# Altium schematic sheet AFE.SchDoc: Straingauge data acquisition board
size A4; CheckedBy: Bogdan Seczkowski; DrawnBy: Bogdan Seczkowski; Revision: A; SheetNumber: 1; SheetTotal: 2
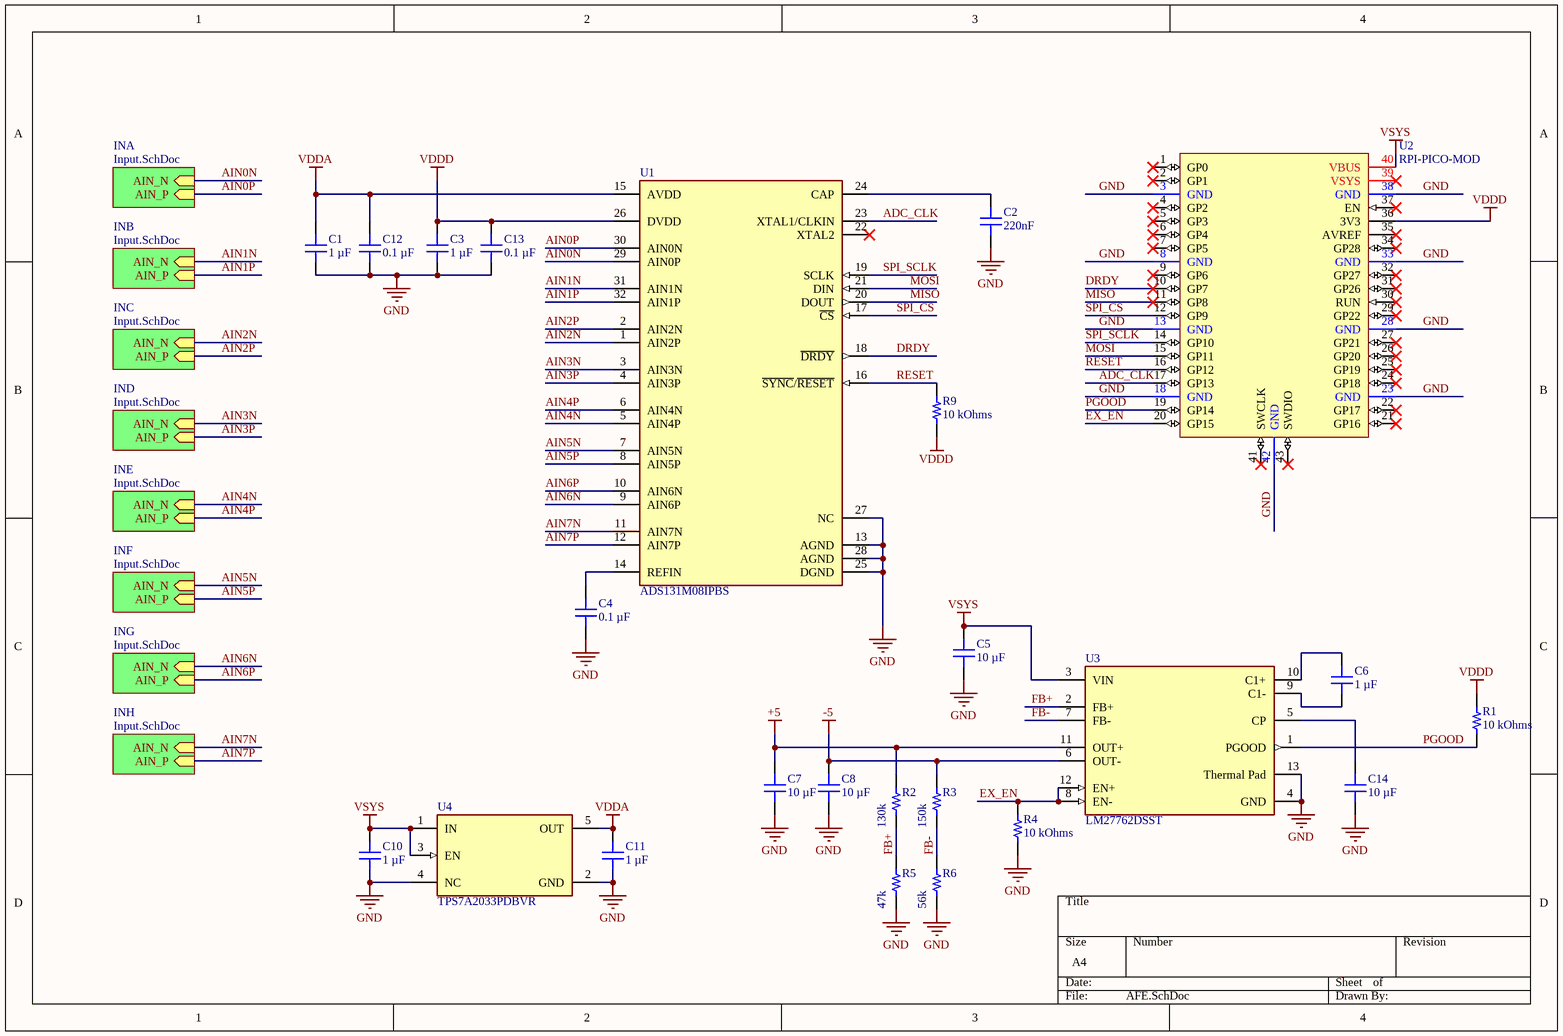
[diagram p0: AFE.SchDoc]

## Parts
C1  1 µF  [CAP 0603_1608]
C2  Capacitance: 220nF  [CAP 0603_1608]  (hidden comment: 0.22 µF)
C3  1 µF  [CAP 0603_1608]
C4  0.1 µF  [CAP 0603_1608]
C5  10 µF  [CAP 0805_2012]
C6  1 µF  [CAP 0603_1608]
C7  10 µF  [CAP 0805_2012]
C8  10 µF  [CAP 0805_2012]
C10  1 µF  [CAP 0603_1608]
C11  1 µF  [CAP 0603_1608]
C12  0.1 µF  [CAP 0603_1608]
C13  0.1 µF  [CAP 0603_1608]
C14  10 µF  [CAP 0805_2012]
R1  10 kOhms  [RES 0603_1608]
R2  130k  [RES 0603_1608]
R3  150k  [RES 0603_1608]
R4  10 kOhms  [RES 0603_1608]
R5  47k  [RES 0603_1608]
R6  56k  [RES 0603_1608]
R9  10 kOhms  [RES 0603_1608]
U1  ADS131M08IPBS  [FP-PBS0032A-MFG]
U2  RPI-PICO-MOD  [RPI-PICO-MOD]
U3  LM27762DSST  [FP-DSS0012B-MFG]
U4  TPS7A2033PDBVR  [FP-DBV0005A-MFG]

## Sub-sheets
INA = Input.SchDoc: AIN_N (in), AIN_P (in)
INB = Input.SchDoc: AIN_N (in), AIN_P (in)
INC = Input.SchDoc: AIN_N (in), AIN_P (in)
IND = Input.SchDoc: AIN_N (in), AIN_P (in)
INE = Input.SchDoc: AIN_N (in), AIN_P (in)
INF = Input.SchDoc: AIN_N (in), AIN_P (in)
ING = Input.SchDoc: AIN_N (in), AIN_P (in)
INH = Input.SchDoc: AIN_N (in), AIN_P (in)

## Nets
+5: C7.2 R2.2 U3.11(OUT+)
-5: C8.2 R3.2 U3.6(OUT-)
GND: C1.1 C2.1 C3.1 C4.1 C5.1 C7.1 C8.1 C10.1 C11.1 C12.1 C13.1 C14.1 R4.1 R5.1 R6.1 U1.13(AGND) U1.25(DGND) U1.27(NC) U1.28(AGND) U2.3(GND) U2.8(GND) U2.13(GND) U2.18(GND) U2.23(GND) U2.28(GND) U2.33(GND) U2.38(GND) U2.42(GND) U3.4(GND) U3.13(Thermal_Pad) U4.2(GND) U4.4(NC)
VDDA: C1.2 C11.2 C12.2 U1.15(AVDD) U4.5(OUT)
VDDD: C3.2 C13.2 R1.2 R9.1 U1.26(DVDD) U2.36(3V3)
VSYS: C5.2 C10.2 U2.40(VBUS) U3.3(VIN) U4.1(IN) U4.3(EN)
ADC_CLK: U1.23(XTAL1/CLKIN) U2.17(GP13)
AIN0N: U1.29(AIN0P) ; sheet INA/AIN_N
AIN0P: U1.30(AIN0N) ; sheet INA/AIN_P
AIN1N: U1.31(AIN1N) ; sheet INB/AIN_N
AIN1P: U1.32(AIN1P) ; sheet INB/AIN_P
AIN2N: U1.1(AIN2P) ; sheet INC/AIN_N
AIN2P: U1.2(AIN2N) ; sheet INC/AIN_P
AIN3N: U1.3(AIN3N) ; sheet IND/AIN_N
AIN3P: U1.4(AIN3P) ; sheet IND/AIN_P
AIN4N: U1.5(AIN4P) ; sheet INE/AIN_N
AIN4P: U1.6(AIN4N) ; sheet INE/AIN_P
AIN5N: U1.7(AIN5N) ; sheet INF/AIN_N
AIN5P: U1.8(AIN5P) ; sheet INF/AIN_P
AIN6N: U1.9(AIN6P) ; sheet ING/AIN_N
AIN6P: U1.10(AIN6N) ; sheet ING/AIN_P
AIN7N: U1.11(AIN7N) ; sheet INH/AIN_N
AIN7P: U1.12(AIN7P) ; sheet INH/AIN_P
DRDY: U1.18(~{DRDY}) U2.10(GP7)
EX_EN: R4.2 U2.20(GP15) U3.8(EN-) U3.12(EN+)
FB+: R2.1 R5.2 U3.2(FB+)
FB-: R3.1 R6.2 U3.7(FB-)
MISO: U1.20(DOUT) U2.11(GP8)
MOSI: U1.21(DIN) U2.15(GP11)
PGOOD: R1.1 U2.19(GP14) U3.1(PGOOD)
RESET: R9.2 U1.16(~{SYNC}/~{RESET}) U2.16(GP12)
SPI_CS: U1.17(~{CS}) U2.12(GP9)
SPI_SCLK: U1.19(SCLK) U2.14(GP10)
NetC2_2: C2.2 U1.24(CAP)
NetC4_2: C4.2 U1.14(REFIN)
NetC6_1: C6.1 U3.9(C1-)
NetC6_2: C6.2 U3.10(C1+)
NetC14_2: C14.2 U3.5(CP)

Not connected (* = marked no-connect by the designer): U1 22(XTAL2)*; U2 1(GP0)* 2(GP1)* 4(GP2)* 5(GP3)* 6(GP4)* 7(GP5)* 9(GP6)* 21(GP16)* 22(GP17)* 24(GP18)* 25(GP19)* 26(GP20)* 27(GP21)* 29(GP22)* 30(RUN)* 31(GP26)* 32(GP27)* 34(GP28)* 35(AVREF)* 37(EN)* 39(VSYS)* 41(SWCLK)* 43(SWDIO)*

## Library data of the parts
C1 C3 C10 C11 = C0603C105K4RACAUTO: CAP CER 1UF 16V X7R 0603; manufacturer: KEMET; Tolerance: ±10%; Part Number: C0603C105K4RACAUTO; Capacitance: 1 µF; Applications: Automotive, Bypass, Decoupling; componentlink1description: Datasheet; componentlink1url: https://api.kemet.com/component-edge/download/datasheet/C0603C105K4RACAUTO.pdf; componentlink2description: DigiKey Link; componentlink2url: https://www.digikey.com/en/products/detail/kemet/C0603C105K4RACAUTO/8635831; Device Package: 0603 (1608 Metric); lastupdated: 2/9/2024 8:10:30 PM; Lifecycle Status: Active; Minimum Order: 1; Mounting Type: Surface Mount, MLCC; Operating Temperature: -55°C ~ 125°C; Package / Case: 0603 (1608 Metric); packaging: TapeAndReel; partid: 2179; Part Status: Active; price: 0.01; Ratings: AEC-Q200; series: SMD Auto X7R; Size / Dimension: 0.063" L x 0.031" W (1.60mm x 0.80mm); Supplier 1: DigiKey; Supplier Part Number 1: 399-17704-1-ND; Temperature Coefficient: X7R; Thickness (Max): 0.037" (0.95mm); value: 1 µF; Voltage - Rated: 16V
C2 = 0603BB224K500YT: CAP CER 0.22UF 50V X7R 0603; manufacturer: Knowles Novacap; Tolerance: ±10%; Part Number: 0603BB224K500YT; Applications: General Purpose; componentlink1description: Datasheet; componentlink1url: https://www.knowlescapacitors.com/getattachment/6c8d48ef-fc2b-4752-ae2c-ce6c208de0c4/High-Capacitance-Chip.aspx; componentlink2description: DigiKey Link; componentlink2url: https://www.digikey.com/en/products/detail/knowles-novacap/0603BB224K500YT/7304085; Device Package: 0603 (1608 Metric); lastupdated: 2/9/2024 8:10:30 PM; Lifecycle Status: Active; Minimum Order: 1; Mounting Type: Surface Mount, MLCC; Operating Temperature: -55°C ~ 125°C; Package / Case: 0603 (1608 Metric); packaging: TapeAndReel; partid: 2162; Part Status: Active; price: 0.49; series: -; Size / Dimension: 0.060" L x 0.030" W (1.52mm x 0.76mm); Supplier 1: DigiKey; Supplier Part Number 1: 1763-1192-1-ND; Temperature Coefficient: X7R; Thickness (Max): 0.035" (0.89mm); value: 0.22 µF; Voltage - Rated: 50V
C4 C12 C13 = C0603C104K5RAC7411: CAP CER 0.1UF 50V X7R 0603; manufacturer: KEMET; Tolerance: ±10%; Part Number: C0603C104K5RAC7411; Capacitance: 0.1 µF; Applications: Bypass, Decoupling; componentlink1description: Datasheet; componentlink1url: https://api.kemet.com/component-edge/download/datasheet/C0603C104K5RAC7411.pdf; componentlink2description: DigiKey Link; componentlink2url: https://www.digikey.com/en/products/detail/kemet/C0603C104K5RAC7411/3317013; Device Package: 0603 (1608 Metric); lastupdated: 2/9/2024 8:10:30 PM; Lifecycle Status: Active; Minimum Order: 1; Mounting Type: Surface Mount, MLCC; Operating Temperature: -55°C ~ 125°C; Package / Case: 0603 (1608 Metric); packaging: TapeAndReel; partid: 2233; Part Status: Active; price: 0.01; series: SMD Comm X7R; Size / Dimension: 0.063" L x 0.031" W (1.60mm x 0.80mm); Supplier 1: DigiKey; Supplier Part Number 1: 399-C0603C104K5RAC7411CT-ND; Temperature Coefficient: X7R; Thickness (Max): 0.035" (0.90mm); value: 0.1 µF; Voltage - Rated: 50V
C5 C7 C8 C14 = CL21Y106KPQVPNE: CAP CER 10UF 10V X7S 0805; manufacturer: Samsung Electro-Mechanics; Tolerance: ±10%; Part Number: CL21Y106KPQVPNE; Capacitance: 10 µF; Applications: Automotive; componentlink1description: Datasheet; componentlink1url: http://www.samsungsem.com/kr/support/product-search/mlcc/CL21Y106KPQVPNE.jsp; componentlink2description: DigiKey Link; componentlink2url: https://www.digikey.com/en/products/detail/samsung-electro-mechanics/CL21Y106KPQVPNE/5961169; Device Package: 0805 (2012 Metric); lastupdated: 2/9/2024 8:16:08 PM; Lifecycle Status: Active; Minimum Order: 1; Mounting Type: Surface Mount, MLCC; Operating Temperature: -55°C ~ 125°C; Package / Case: 0805 (2012 Metric); packaging: TapeAndReel; partid: 2979; Part Status: Active; price: 0.06; Ratings: AEC-Q200; series: CL; Size / Dimension: 0.079" L x 0.049" W (2.00mm x 1.25mm); Supplier 1: DigiKey; Supplier Part Number 1: 1276-6685-1-ND; Temperature Coefficient: X7S; Thickness (Max): 0.055" (1.40mm); value: 10 µF; Voltage - Rated: 10V
C6 = CC0603KRX7R6BB105: CAP CER 1UF 10V X7R 0603; manufacturer: Yageo; Tolerance: ±10%; Part Number: CC0603KRX7R6BB105; Capacitance: 1 µF; Applications: General Purpose; componentlink1description: Datasheet; componentlink1url: https://www.yageo.com/upload/media/product/productsearch/datasheet/mlcc/UPY-GPHC_X7R_6.3V-to-50V_18.pdf; componentlink2description: DigiKey Link; componentlink2url: https://www.digikey.com/en/products/detail/yageo/CC0603KRX7R6BB105/5195204; Device Package: 0603 (1608 Metric); lastupdated: 2/9/2024 8:10:30 PM; Lifecycle Status: Active; Minimum Order: 1; Mounting Type: Surface Mount, MLCC; Operating Temperature: -55°C ~ 125°C; Package / Case: 0603 (1608 Metric); packaging: TapeAndReel; partid: 2290; Part Status: Active; price: 0.01; series: CC; Size / Dimension: 0.063" L x 0.031" W (1.60mm x 0.80mm); Supplier 1: DigiKey; Supplier Part Number 1: 311-1796-1-ND; Temperature Coefficient: X7R; Thickness (Max): 0.035" (0.90mm); value: 1 µF; Voltage - Rated: 10V
R1 R4 R9 = RNCS0603BKE10K0: RES 10K OHM 0.1% 1/16W 0603; Manufacturer: Stackpole Electronics Inc; Power (Watts): 0.063W, 1/16W; Temperature Coefficient: ±25ppm/°C; Part Number: RNCS0603BKE10K0; Value: 10 kOhms; ComponentLink1Description: Datasheet; ComponentLink1URL: https://www.seielect.com/catalog/sei-rncs_rnch.pdf; ComponentLink2Description: DigiKey Link; ComponentLink2URL: https://www.digikey.com/en/products/detail/stackpole-electronics-inc/RNCS0603BKE10K0/1708836; Composition: Thin Film; Device Package: 0603 (1608 Metric); Features: Anti-Corrosive, Automotive AEC-Q200, Moisture Resistant; Height - Seated (Max): 0.022" (0.55mm); LastUpdated: 2/9/2024 8:43:37 PM; Lifecycle Status: Active; Minimum Order: 1; Number of Terminations: 2; Operating Temperature: -55°C ~ 155°C; Package / Case: 0603 (1608 Metric); Packaging: TapeAndReel; PartId: 4838; Part Status: Active; Price: 0.06; Ratings: AEC-Q200; Resistance: 10 kOhms; Series: RNCS; Size / Dimension: 0.061" L x 0.031" W (1.55mm x 0.80mm); Supplier 1: DigiKey; Supplier Part Number 1: RNCS0603BKE10K0CT-ND; Supplier Device Package: 0603; Tolerance: ±0.1%
R2 R3 R5 R6 = RNCS0603BKE10K0: RES 10K OHM 0.1% 1/16W 0603; Manufacturer: Stackpole Electronics Inc; Power (Watts): 0.063W, 1/16W; Resistance: 10 kOhms; Temperature Coefficient: ±25ppm/°C; Part Number: RNCS0603BKE10K0; ComponentLink1Description: Datasheet; ComponentLink1URL: https://www.seielect.com/catalog/sei-rncs_rnch.pdf; ComponentLink2Description: DigiKey Link; ComponentLink2URL: https://www.digikey.com/en/products/detail/stackpole-electronics-inc/RNCS0603BKE10K0/1708836; Composition: Thin Film; Device Package: 0603 (1608 Metric); Features: Anti-Corrosive, Automotive AEC-Q200, Moisture Resistant; Height - Seated (Max): 0.022" (0.55mm); LastUpdated: 2/9/2024 8:43:37 PM; Lifecycle Status: Active; Minimum Order: 1; Number of Terminations: 2; Operating Temperature: -55°C ~ 155°C; Package / Case: 0603 (1608 Metric); Packaging: TapeAndReel; PartId: 4838; Part Status: Active; Price: 0.06; Ratings: AEC-Q200; Series: RNCS; Size / Dimension: 0.061" L x 0.031" W (1.55mm x 0.80mm); Supplier 1: DigiKey; Supplier Part Number 1: RNCS0603BKE10K0CT-ND; Supplier Device Package: 0603; Tolerance: ±0.1%
  R2: Value: 130k
  R3: Value: 150k
  R5: Value: 47k
  R6: Value: 56k
U1 = CMP-04860-000022-1: 8 CHANNEL 24 BIT SIMULTANEOUS SA
U2 = CMP-007-000000-5: RASPBERRY PI PICO RP2040 BOARD; Manufacturer Part No: SC0915; Manufacturer: Raspberry Pi Foundation; Supplier Part No: 2648-SC0915CT-ND; Design Item ID: RPI-PICO-MOD; Mounting Technology: SMT; Source: RPi_Pico.SchLib; Supplier Link: https://www.digikey.com/en/products/detail/raspberry-pi/SC0915/13684020
U3 = CMP-019-00052-2: Switched Capacitor Converter, 0.25A, 2200kHz Switching Freq-Max, PDSO12; Frequency: 2.3MHz; Max Supply Voltage: 5.5V; Pins: 12; Case/Package: HVSON; RoHS Compliant: Yes; Min Operating Temperature: -40°C; Max Operating Temperature: 85°C
U4 = CMP-04917-000300-1: IC REG LINEAR 3.3V 300MA SOT23-5; RoHS Compliant: Yes